# EAGLE schematic 2nd to final draft (EAGLE 8.1.0)

## Sheet 1 of 2
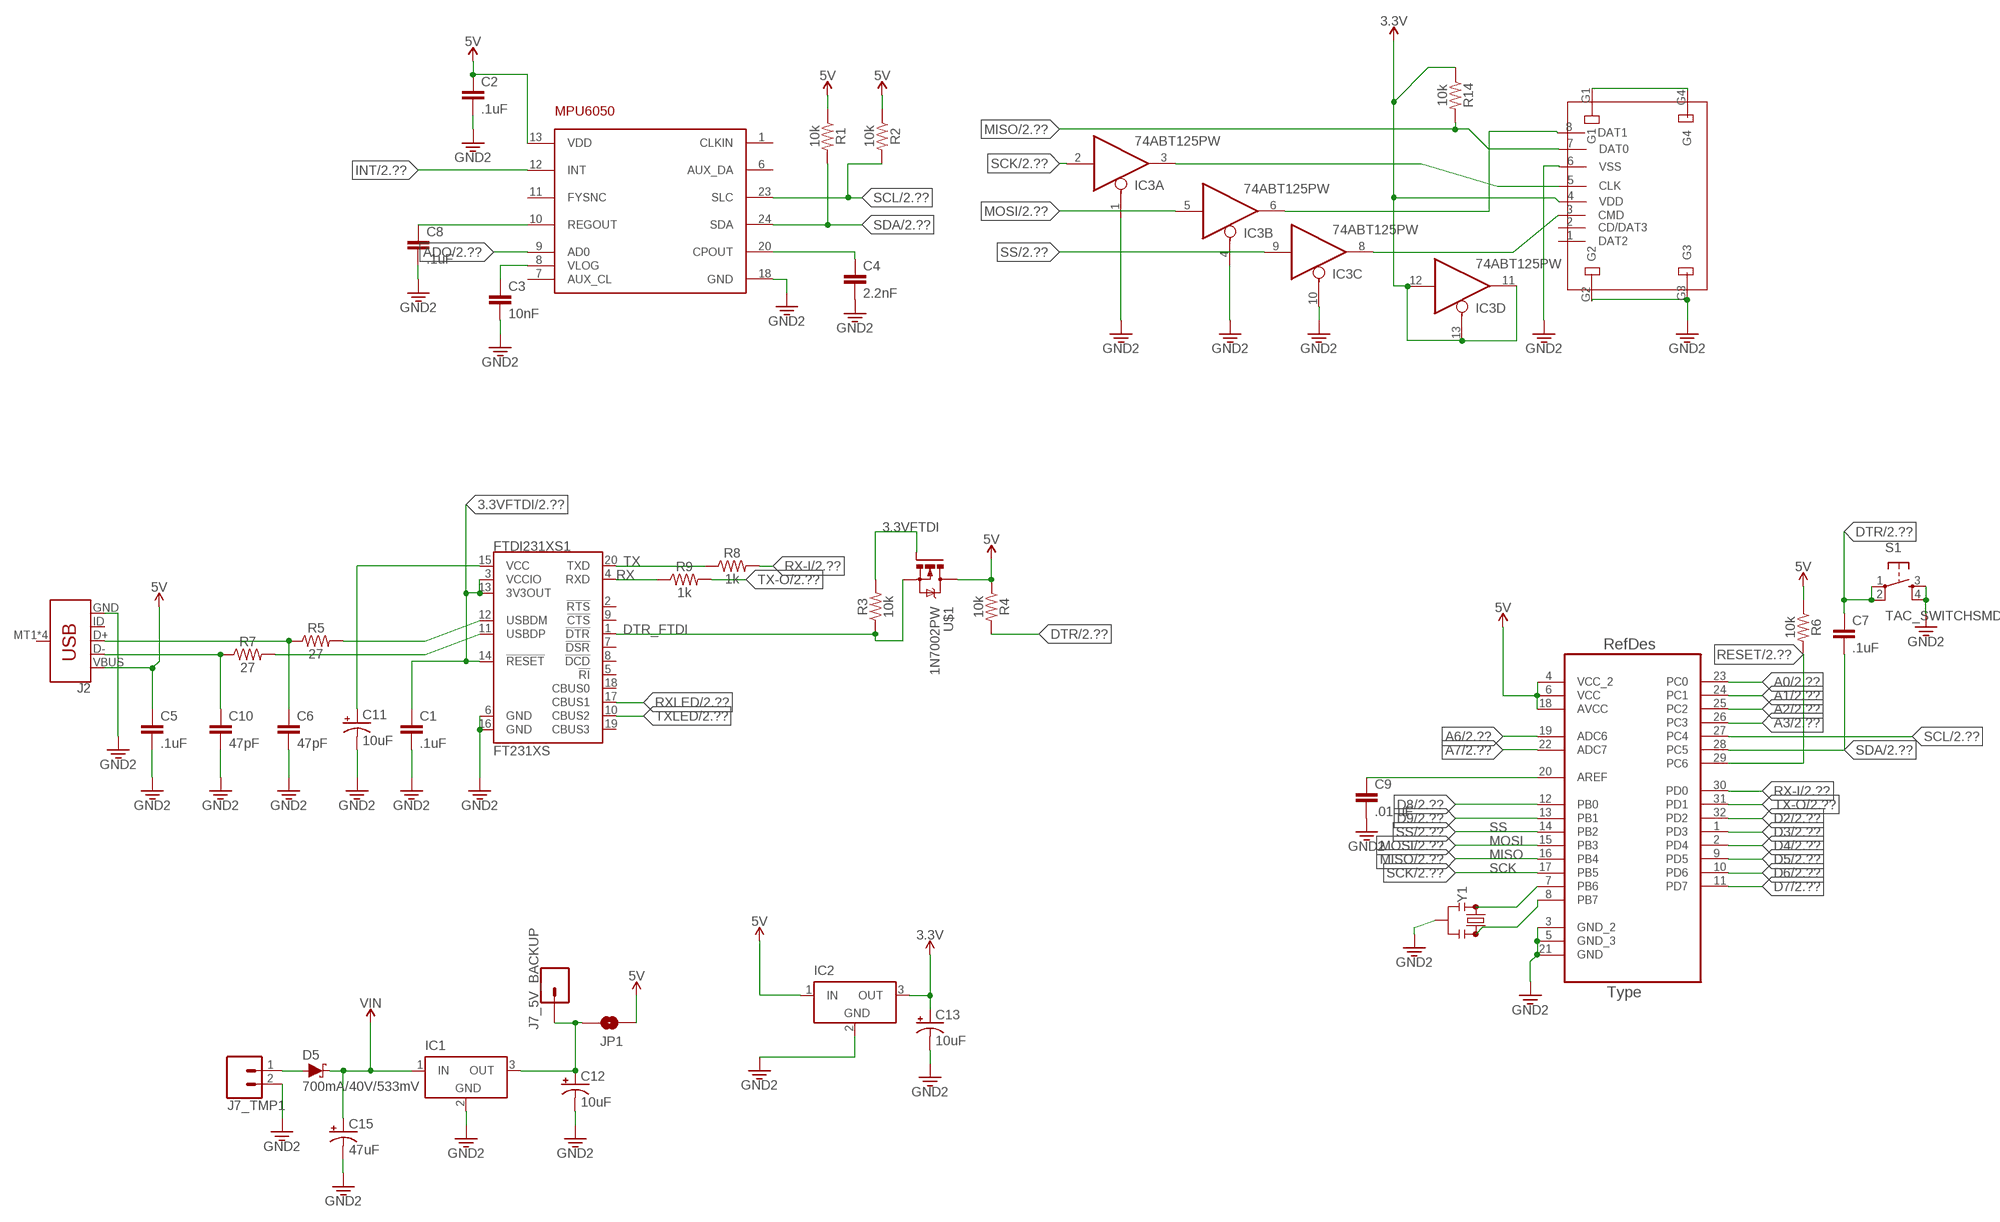
[diagram p0: schematic, sheet 1, part 1 of 2]
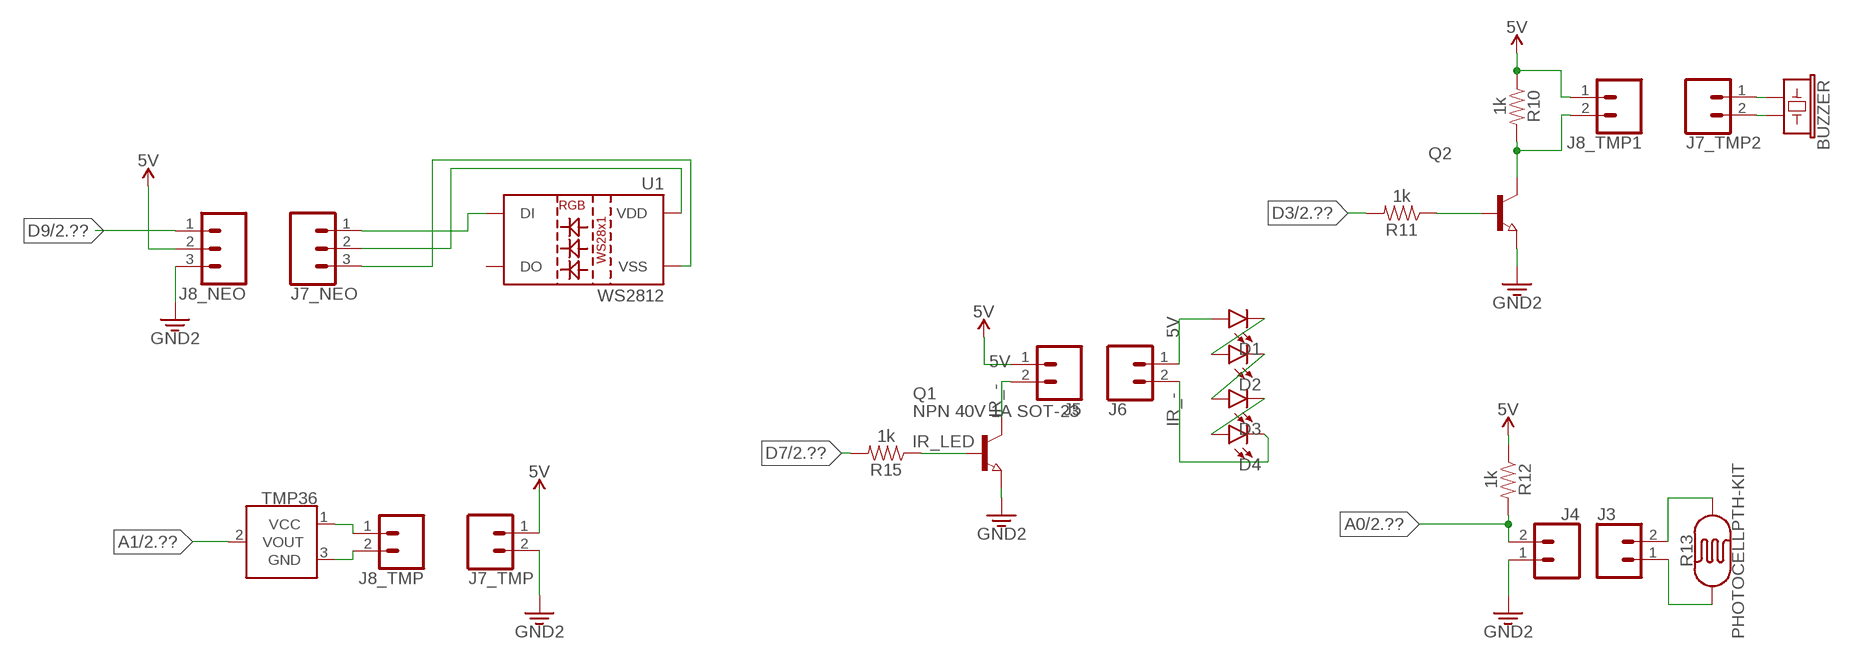
[diagram p1: schematic, sheet 1, part 2 of 2]

### Parts
ATMEGA328P-AU  ATMEGA328P-AU  [QFP80P900X900X120-32N]
BUZZER  BUZZER-PTH  [BUZZER-12MM]
C1  .1uF  .22UF-CER  [0402-CAP]
C2  .1uF  .22UF-CER  [0402-CAP]
C3  10nF  .22UF-CER  [0402-CAP]
C4  2.2nF  .22UF-CER  [0402-CAP]
C5  .1uF  .22UF-CER  [0402-CAP]
C6  47pF  .22UF-CER  [0402-CAP]
C7  .1uF  .22UF-CER  [0402-CAP]
C8  .1uF  .22UF-CER  [0402-CAP]
C9  .01 uF  .22UF-CER  [0402-CAP]
C10  47pF  .22UF-CER  [0402-CAP]
C11  10uF  10UF-TANT  [EIA3216]
C12  10uF  10UF-TANT  [EIA3216]
C13  10uF  10UF-TANT  [EIA3216]
C15  47uF  10UF-TANT  [EIA3216]
D1  LED-IRTSAL6100  [LED_5MM]
D2  LED-IRTSAL6100  [LED_5MM]
D3  LED-IRTSAL6100  [LED_5MM]
D4  LED-IRTSAL6100  [LED_5MM]
D5  700mA/40V/533mV  DIODE-SCHOTTKY-ZLLS500  [SOT23-3]
FTDI231XS1  FT231XS  [SSOP20_L]
IC1  LT1129CST5  [SOT223]
IC2  LT1129CST5  [SOT223]
IC3  74ABT125PW  [TSSOP14]
J2  USB_MICRO-B_SMT  [USB-MICROB]
J3  CONN_02LOCK  [1X02_LOCK]
J4  CONN_02LOCK  [1X02_LOCK]
J5  CONN_02LOCK  [1X02_LOCK]
J6  CONN_02LOCK  [1X02_LOCK]
J7_5V_BACKUP  CONN_01  [1X01]
J7_NEO  CONN_03-SCREW-5MM  [SCREWTERMINAL-5MM-3]
J7_TMP  CONN_02LOCK  [1X02_LOCK]
J7_TMP1  CONN_02LOCK  [1X02_LOCK]
J7_TMP2  CONN_02LOCK  [1X02_LOCK]
J8_NEO  CONN_03-SCREW-5MM  [SCREWTERMINAL-5MM-3]
J8_TMP  CONN_02LOCK  [1X02_LOCK]
J8_TMP1  CONN_02LOCK  [1X02_LOCK]
JP1  JUMPER-SMT_2_NO_NO-SILK_ROUND  [SMT-JUMPER_2_NO_NO-SILK_ROUND]
MPU6050  MPU-6050  [QFN24-4X4]
Q1  NPN 40V 1A SOT-23  NPN-TRANSISTOR_SOT23  [SOT23]
Q2  NPN-TRANSISTOR_SOT23  [SOT23]
R1  10k  0.05OHM-0603-1/5W-1%  [0603]
R2  10k  0.05OHM-0603-1/5W-1%  [0603]
R3  10k  0.05OHM-0603-1/5W-1%  [0603]
R4  10k  0.05OHM-0603-1/5W-1%  [0603]
R5  27  0.05OHM-0603-1/5W-1%  [0603]
R6  10k  0.05OHM-0603-1/5W-1%  [0603]
R7  27  0.05OHM-0603-1/5W-1%  [0603]
R8  1k  0.05OHM-0603-1/5W-1%  [0603]
R9  1k  0.05OHM-0603-1/5W-1%  [0603]
R10  1k  0.05OHM-0603-1/5W-1%  [0603]
R11  1k  0.05OHM-0603-1/5W-1%  [0603]
R12  1k  0.05OHM-0603-1/5W-1%  [0603]
R13  PHOTOCELLPTH-KIT  [PHOTOCELL-KIT]
R14  10k  0.05OHM-0603-1/5W-1%  [0603]
R15  1k  0.05OHM-0603-1/5W-1%  [0603]
S1  TAC_SWITCHSMD  [TACTILE-SWITCH-SMD]
TMP36  TMP36GT9  [TO-92]
U1  WS2812  WS2812"  [LED-TRICOLOR-5050-IC]
U$1  1N7002PW  [SOT323W_INFINEON]
U$2  WM6698TR-ND_MICROSD  [MICROSD_DIGIKEY]
Y1  RESONATORSMD-7.4X3.4  [RESONATOR-SMD-7.4X3.4]

### Nets
3.3V: ATMEGA328P-AU.3(GND_2) ATMEGA328P-AU.5(GND_3) ATMEGA328P-AU.21(GND) C1.2 C2.2 C3.2 C4.2 C5.2 C6.2 C8.2 C9.2 C10.2 C11.C(-) C12.C(-) C13.C(-) C15.C(-) FTDI231XS1.6(GND) FTDI231XS1.16(GND) IC1.2(GND) IC2.2(GND) IC3.1(A:OE) IC3.4(B:OE) IC3.10(C:OE) J2.GND J7_TMP1.2 J8_NEO.3 MPU6050.18(GND) Q1.2(E) Q2.2(E) S1.3 S1.4 U$2.6(VSS) U$2.G2 U$2.G3 Y1.2 ; supply symbol labelled GND2 ; also sheet 2
3.3VFTDI: C1.1 FTDI231XS1.3(VCCIO) FTDI231XS1.13(3V3OUT) FTDI231XS1.14(!RESET) R3.2 U$1.1(G) ; also sheet 2
5V: ATMEGA328P-AU.4(VCC_2) ATMEGA328P-AU.6(VCC) ATMEGA328P-AU.18(AVCC) C2.1 C5.1 D1.A IC2.1(IN) J2.VBUS J5.1 J6.1 J7_NEO.1 J8_NEO.2 JP1.1 MPU6050.13(VDD) R1.1 R2.1 R4.1 R6.1 R12.1 U1.2(DI) U$1.3(D) ; also sheet 2
A0: ATMEGA328P-AU.23(PC0) J3.2 J4.2 R12.2 R13.2 ; also sheet 2
A1: ATMEGA328P-AU.24(PC1) TMP36.2(VOUT) ; also sheet 2
A2: ATMEGA328P-AU.25(PC2) ; also sheet 2
A3: ATMEGA328P-AU.26(PC3) ; also sheet 2
A6: ATMEGA328P-AU.19(ADC6) ; also sheet 2
A7: ATMEGA328P-AU.22(ADC7) ; also sheet 2
ADO: MPU6050.9(AD0) ; also sheet 2
BUZ+: BUZZER.+ J7_TMP2.1 J8_TMP1.1 R10.1 ; supply symbol labelled 5V
BUZ-: BUZZER.- J7_TMP2.2 J8_TMP1.2 Q2.3(C) R10.2
D2: ATMEGA328P-AU.32(PD2) ; also sheet 2
D3: ATMEGA328P-AU.1(PD3) R11.2 ; also sheet 2
D4: ATMEGA328P-AU.2(PD4) ; also sheet 2
D5: ATMEGA328P-AU.9(PD5) ; also sheet 2
D6: ATMEGA328P-AU.10(PD6) ; also sheet 2
D7: ATMEGA328P-AU.11(PD7) R15.2 ; also sheet 2
D8: ATMEGA328P-AU.12(PB0) ; also sheet 2
D9: ATMEGA328P-AU.13(PB1) J7_NEO.2 J8_NEO.1 U1.3(VDD) U1.5(VDD) ; also sheet 2
DTR: C7.1 R4.2 S1.1 S1.2 ; also sheet 2
DTR_FTDI: FTDI231XS1.1(!DTR) R3.1 U$1.2(S) ; also sheet 2
GND: J3.1 J4.1 J7_NEO.3 R13.1 U1.6(VSS) ; supply symbol labelled GND2
INT: MPU6050.12(INT) ; also sheet 2
IR_-: D4.K(C) J5.2 J6.2 Q1.3(C)
IR_LED: Q1.1(B) R15.1
MISO: ATMEGA328P-AU.16(PB4) R14.2 U$2.7(DAT0) ; also sheet 2
MOSI: ATMEGA328P-AU.15(PB3) IC3.5(B:I) ; also sheet 2
N$1: ATMEGA328P-AU.7(PB6) Y1.1
N$2: ATMEGA328P-AU.8(PB7) Y1.3
N$3: C4.1 MPU6050.20(CPOUT)
N$4: C8.1 MPU6050.10(REGOUT)
N$5: C3.1 MPU6050.8(VLOG)
N$6: ATMEGA328P-AU.20(AREF) C9.1
N$7: C6.1 J2.D+ R5.1
N$8: U$2.G1 U$2.G4
N$9: IC3.3(A:O) U$2.5(CLK)
N$10: IC3.6(B:O) U$2.8(DAT1)
N$11: IC3.8(C:O) U$2.3(CMD)
N$13: C10.1 J2.D- R7.1
N$14: FTDI231XS1.11(USBDP) R7.2
N$15: FTDI231XS1.12(USBDM) R5.2
N$16: C11.A(+) FTDI231XS1.15(VCC)
N$18: D1.K(C) D2.A
N$19: D2.K(C) D3.A
N$20: Q2.1(B) R11.1
N$21: D3.K(C) D4.A
N$22: D5.1(A) J7_TMP1.1
N$23: C12.A(+) IC1.3(OUT) J7_5V_BACKUP.1 JP1.2
RESET: ATMEGA328P-AU.29(PC6) R6.2 ; also sheet 2
RX: FTDI231XS1.4(RXD) R9.1 ; also sheet 2
RX-I: ATMEGA328P-AU.30(PD0) R8.2 ; also sheet 2
RXLED: FTDI231XS1.17(CBUS1) ; also sheet 2
SCK: ATMEGA328P-AU.17(PB5) IC3.2(A:I) ; also sheet 2
SCL: ATMEGA328P-AU.27(PC4) MPU6050.23(SLC) R2.2 ; also sheet 2
SDA: ATMEGA328P-AU.28(PC5) C7.2 MPU6050.24(SDA) R1.2 ; also sheet 2
SS: ATMEGA328P-AU.14(PB2) IC3.9(C:I) ; also sheet 2
TMP+: J7_TMP.1 J8_TMP.1 TMP36.1(VCC) ; supply symbol labelled 5V
TMP-: J7_TMP.2 J8_TMP.2 TMP36.3(GND) ; supply symbol labelled GND2
TX: FTDI231XS1.20(TXD) R8.1 ; also sheet 2
TX-O: ATMEGA328P-AU.31(PD1) R9.2 ; also sheet 2
TXLED: FTDI231XS1.10(CBUS2) ; also sheet 2
VCC: C13.A(+) IC2.3(OUT) IC3.11(D:O) IC3.12(D:I) IC3.13(D:OE) R14.1 U$2.4(VDD) ; supply symbol labelled 3.3V ; also sheet 2
VIN: C15.A(+) D5.3(C) IC1.1(IN) ; also sheet 2
Unconnected: FTDI231XS1.2(!RTS) FTDI231XS1.5(!RI) FTDI231XS1.7(!DSR) FTDI231XS1.8(!DCD) FTDI231XS1.9(!CTS) FTDI231XS1.18(CBUS0) FTDI231XS1.19(CBUS3) J2.ID J2.MT1(SHIELD) J2.MT2(SHIELD) J2.P$1(SHIELD) J2.P$2(SHIELD) MPU6050.1(CLKIN) MPU6050.6(AUX_DA) MPU6050.7(AUX_CL) MPU6050.11(FYSNC) U1.1(DO) U$2.1(DAT2) U$2.2(CD/DAT3)

## Sheet 2 of 2
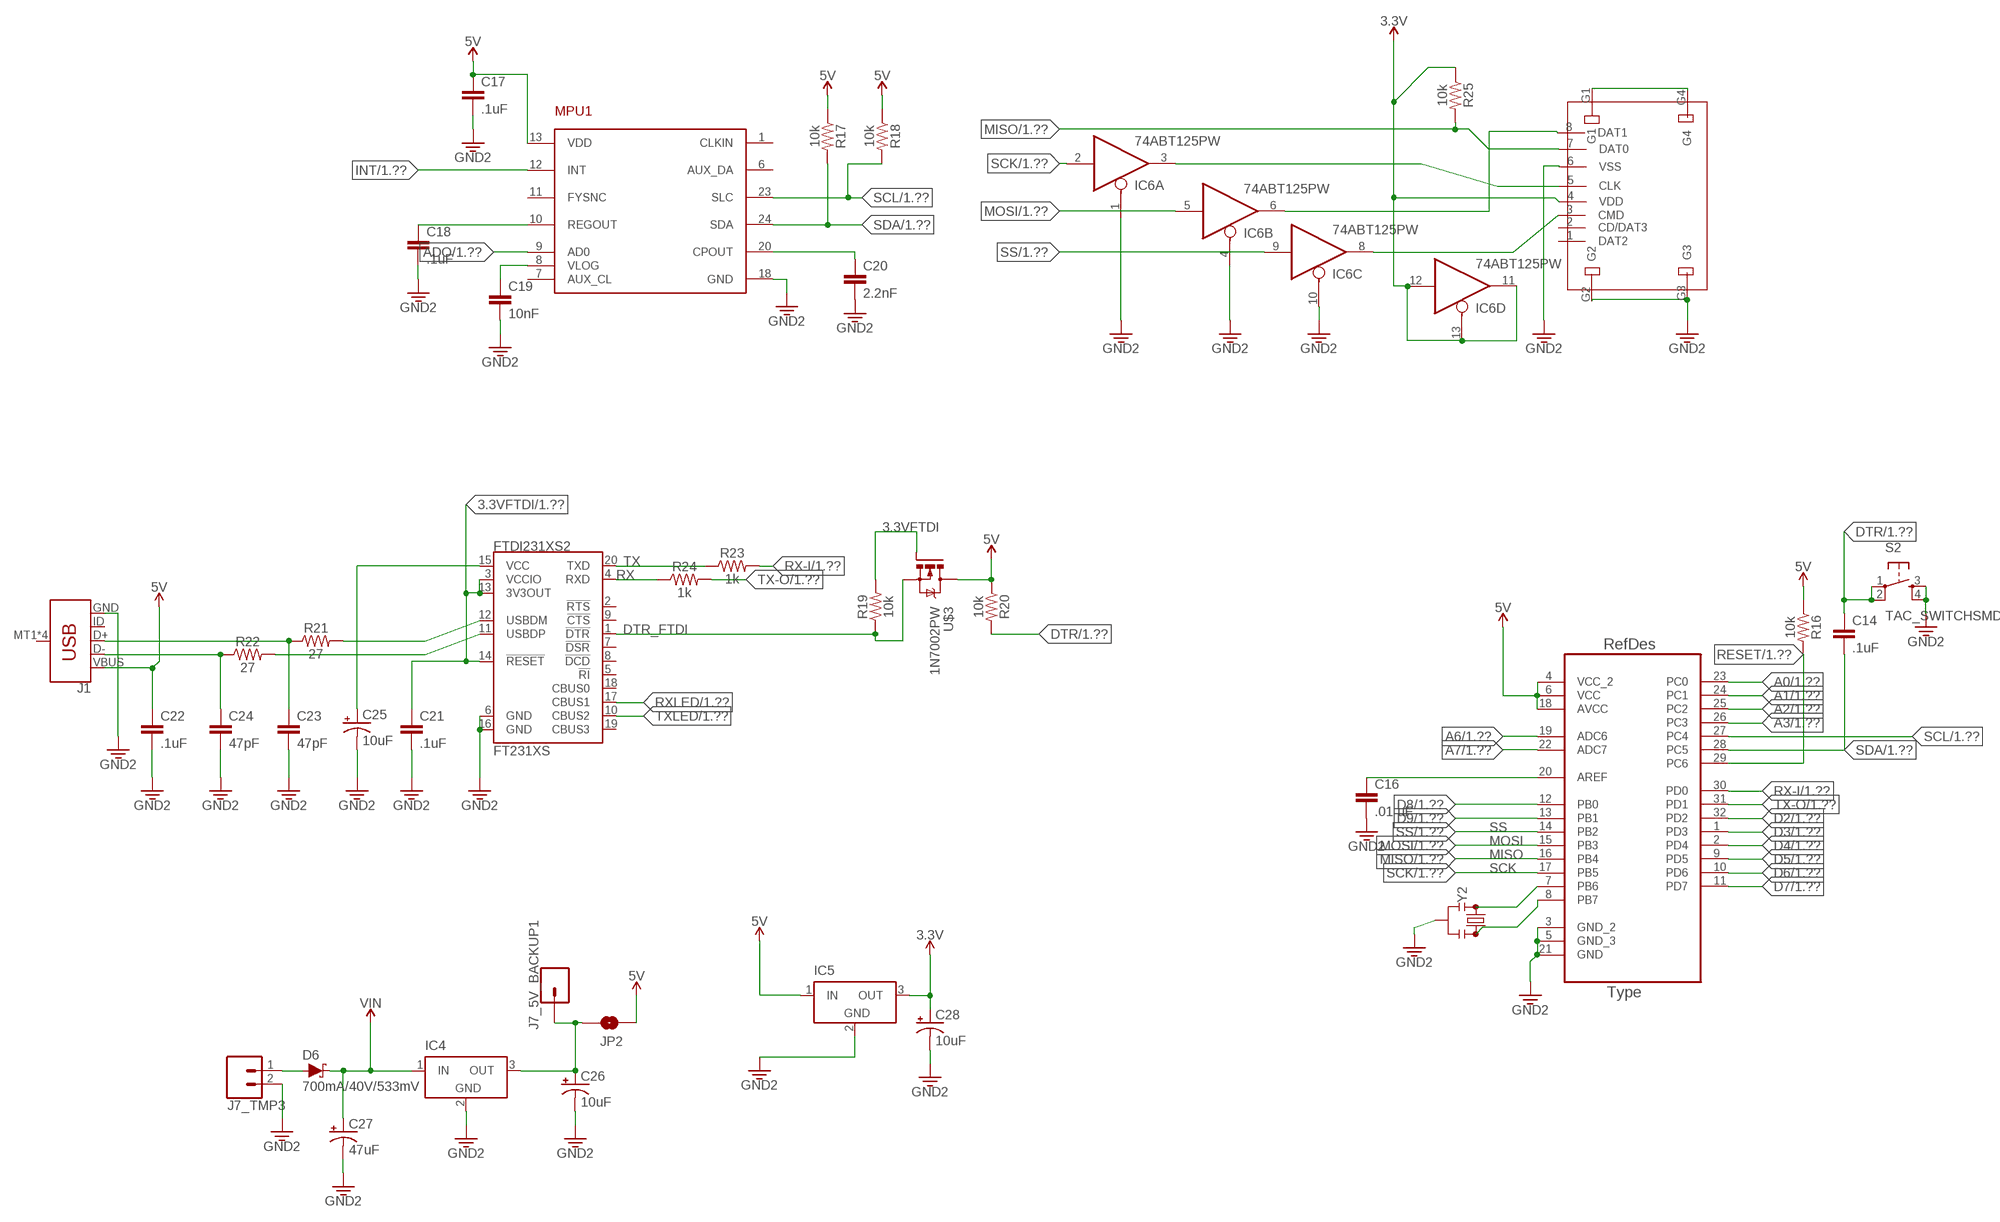
[diagram p2: schematic, sheet 2]

### Parts
ATMEGA328P-AU1  ATMEGA328P-AU  [QFP80P900X900X120-32N]
C14  .1uF  .22UF-CER  [0402-CAP]
C16  .01 uF  .22UF-CER  [0402-CAP]
C17  .1uF  .22UF-CER  [0402-CAP]
C18  .1uF  .22UF-CER  [0402-CAP]
C19  10nF  .22UF-CER  [0402-CAP]
C20  2.2nF  .22UF-CER  [0402-CAP]
C21  .1uF  .22UF-CER  [0402-CAP]
C22  .1uF  .22UF-CER  [0402-CAP]
C23  47pF  .22UF-CER  [0402-CAP]
C24  47pF  .22UF-CER  [0402-CAP]
C25  10uF  10UF-TANT  [EIA3216]
C26  10uF  10UF-TANT  [EIA3216]
C27  47uF  10UF-TANT  [EIA3216]
C28  10uF  10UF-TANT  [EIA3216]
D6  700mA/40V/533mV  DIODE-SCHOTTKY-ZLLS500  [SOT23-3]
FTDI231XS2  FT231XS  [SSOP20_L]
IC4  LT1129CST5  [SOT223]
IC5  LT1129CST5  [SOT223]
IC6  74ABT125PW  [TSSOP14]
J1  USB_MICRO-B_SMT  [USB-MICROB]
J7_5V_BACKUP1  CONN_01  [1X01]
J7_TMP3  CONN_02LOCK  [1X02_LOCK]
JP2  JUMPER-SMT_2_NO_NO-SILK_ROUND  [SMT-JUMPER_2_NO_NO-SILK_ROUND]
MPU1  MPU-6050  [QFN24-4X4]
R16  10k  0.05OHM-0603-1/5W-1%  [0603]
R17  10k  0.05OHM-0603-1/5W-1%  [0603]
R18  10k  0.05OHM-0603-1/5W-1%  [0603]
R19  10k  0.05OHM-0603-1/5W-1%  [0603]
R20  10k  0.05OHM-0603-1/5W-1%  [0603]
R21  27  0.05OHM-0603-1/5W-1%  [0603]
R22  27  0.05OHM-0603-1/5W-1%  [0603]
R23  1k  0.05OHM-0603-1/5W-1%  [0603]
R24  1k  0.05OHM-0603-1/5W-1%  [0603]
R25  10k  0.05OHM-0603-1/5W-1%  [0603]
S2  TAC_SWITCHSMD  [TACTILE-SWITCH-SMD]
U$3  1N7002PW  [SOT323W_INFINEON]
U$4  WM6698TR-ND_MICROSD  [MICROSD_DIGIKEY]
Y2  RESONATORSMD-7.4X3.4  [RESONATOR-SMD-7.4X3.4]

### Nets
3.3V: ATMEGA328P-AU1.3(GND_2) ATMEGA328P-AU1.5(GND_3) ATMEGA328P-AU1.21(GND) C16.2 C17.2 C18.2 C19.2 C20.2 C21.2 C22.2 C23.2 C24.2 C25.C(-) C26.C(-) C27.C(-) C28.C(-) FTDI231XS2.6(GND) FTDI231XS2.16(GND) IC4.2(GND) IC5.2(GND) IC6.1(A:OE) IC6.4(B:OE) IC6.10(C:OE) J1.GND J7_TMP3.2 MPU1.18(GND) S2.3 S2.4 U$4.6(VSS) U$4.G2 U$4.G3 Y2.2 ; supply symbol labelled GND2 ; also sheet 1
3.3VFTDI: C21.1 FTDI231XS2.3(VCCIO) FTDI231XS2.13(3V3OUT) FTDI231XS2.14(!RESET) R19.2 U$3.1(G) ; also sheet 1
5V: ATMEGA328P-AU1.4(VCC_2) ATMEGA328P-AU1.6(VCC) ATMEGA328P-AU1.18(AVCC) C17.1 C22.1 IC5.1(IN) J1.VBUS JP2.1 MPU1.13(VDD) R16.1 R17.1 R18.1 R20.1 U$3.3(D) ; also sheet 1
A0: ATMEGA328P-AU1.23(PC0) ; also sheet 1
A1: ATMEGA328P-AU1.24(PC1) ; also sheet 1
A2: ATMEGA328P-AU1.25(PC2) ; also sheet 1
A3: ATMEGA328P-AU1.26(PC3) ; also sheet 1
A6: ATMEGA328P-AU1.19(ADC6) ; also sheet 1
A7: ATMEGA328P-AU1.22(ADC7) ; also sheet 1
ADO: MPU1.9(AD0) ; also sheet 1
D2: ATMEGA328P-AU1.32(PD2) ; also sheet 1
D3: ATMEGA328P-AU1.1(PD3) ; also sheet 1
D4: ATMEGA328P-AU1.2(PD4) ; also sheet 1
D5: ATMEGA328P-AU1.9(PD5) ; also sheet 1
D6: ATMEGA328P-AU1.10(PD6) ; also sheet 1
D7: ATMEGA328P-AU1.11(PD7) ; also sheet 1
D8: ATMEGA328P-AU1.12(PB0) ; also sheet 1
D9: ATMEGA328P-AU1.13(PB1) ; also sheet 1
DTR: C14.1 R20.2 S2.1 S2.2 ; also sheet 1
DTR_FTDI: FTDI231XS2.1(!DTR) R19.1 U$3.2(S) ; also sheet 1
INT: MPU1.12(INT) ; also sheet 1
MISO: ATMEGA328P-AU1.16(PB4) R25.2 U$4.7(DAT0) ; also sheet 1
MOSI: ATMEGA328P-AU1.15(PB3) IC6.5(B:I) ; also sheet 1
N$32: ATMEGA328P-AU1.20(AREF) C16.1
N$33: ATMEGA328P-AU1.7(PB6) Y2.1
N$34: ATMEGA328P-AU1.8(PB7) Y2.3
N$35: C20.1 MPU1.20(CPOUT)
N$36: C18.1 MPU1.10(REGOUT)
N$37: C19.1 MPU1.8(VLOG)
N$38: C23.1 J1.D+ R21.1
N$39: C24.1 J1.D- R22.1
N$40: FTDI231XS2.11(USBDP) R22.2
N$41: FTDI231XS2.12(USBDM) R21.2
N$42: C25.A(+) FTDI231XS2.15(VCC)
N$43: D6.1(A) J7_TMP3.1
N$44: C26.A(+) IC4.3(OUT) J7_5V_BACKUP1.1 JP2.2
N$45: U$4.G1 U$4.G4
N$46: IC6.3(A:O) U$4.5(CLK)
N$47: IC6.6(B:O) U$4.8(DAT1)
N$48: IC6.8(C:O) U$4.3(CMD)
RESET: ATMEGA328P-AU1.29(PC6) R16.2 ; also sheet 1
RX: FTDI231XS2.4(RXD) R24.1 ; also sheet 1
RX-I: ATMEGA328P-AU1.30(PD0) R23.2 ; also sheet 1
RXLED: FTDI231XS2.17(CBUS1) ; also sheet 1
SCK: ATMEGA328P-AU1.17(PB5) IC6.2(A:I) ; also sheet 1
SCL: ATMEGA328P-AU1.27(PC4) MPU1.23(SLC) R18.2 ; also sheet 1
SDA: ATMEGA328P-AU1.28(PC5) C14.2 MPU1.24(SDA) R17.2 ; also sheet 1
SS: ATMEGA328P-AU1.14(PB2) IC6.9(C:I) ; also sheet 1
TX: FTDI231XS2.20(TXD) R23.1 ; also sheet 1
TX-O: ATMEGA328P-AU1.31(PD1) R24.2 ; also sheet 1
TXLED: FTDI231XS2.10(CBUS2) ; also sheet 1
VCC: C28.A(+) IC5.3(OUT) IC6.11(D:O) IC6.12(D:I) IC6.13(D:OE) R25.1 U$4.4(VDD) ; supply symbol labelled 3.3V ; also sheet 1
VIN: C27.A(+) D6.3(C) IC4.1(IN) ; also sheet 1
Unconnected: FTDI231XS2.2(!RTS) FTDI231XS2.5(!RI) FTDI231XS2.7(!DSR) FTDI231XS2.8(!DCD) FTDI231XS2.9(!CTS) FTDI231XS2.18(CBUS0) FTDI231XS2.19(CBUS3) J1.ID J1.MT1(SHIELD) J1.MT2(SHIELD) J1.P$1(SHIELD) J1.P$2(SHIELD) MPU1.1(CLKIN) MPU1.6(AUX_DA) MPU1.7(AUX_CL) MPU1.11(FYSNC) U$4.1(DAT2) U$4.2(CD/DAT3)

## Power pins joined to a net without a drawn wire
GND: IC1.4(GND) IC2.4(GND) IC3.7(P:GND) IC4.4(GND) IC5.4(GND) IC6.7(P:GND)
VCC: IC3.14(P:VCC) IC6.14(P:VCC)

## Library data of the parts
ATMEGA328P-AU ATMEGA328P-AU1 = Atmega-328pu:ATMEGA328P-AU; DESCRIPTION: 8-bit Microcontroller with In-System Programmable Flash; MPN: ATMEGA328P-AU; OC_FARNELL: 1715486; OC_NEWARK: 14R4631; PACKAGE: TQFP-32; SUPPLIER: Atmel
BUZZER = SparkFun-Electromechanical:BUZZER: Buzzer Small round buzzers that operate around the audible 2kHz range. You can use these as speakers to create simple music or user interfaces. Variant Overview: PTH - Mini Speaker - PC Mount 12mm 2.048kHz <https://www.sparkfun.com/products/7950> PTH_KIT - Mini Speaker - PC Mount 12mm 2.048kHz <https://www.sparkfun.com/products/7950> KIT simplifies soldering by adding stop mask to one side of the pads. PTH_NO_SILK - Mini Speaker - PC Mount 12mm 2.048kHz <https://www.sparkfun.com/products/7950> No silkscreen indicator of buzzer outline. PTH_KIT_NO_SILK - Mini Speaker - PC Mount 12mm 2.048kHz <https://www.sparkfun.com/products/7950> KIT package w/o silkscreen SMD - Buzzer Audio Magnetic (CCV-084B16) SMD buzzer used on, e.g. the LilyPad Buzzer <https://www.sparkfun.com/products/8463> and RFID USB Reader <https://www.sparkfun.com/products/9963>. SMD_KIT - Buzzer Audio Magnetic (CCV-084B16) SMD Buzzer with elongated pins to make soldering easier. Used on the SparkFun Simon Says - Surface Mount Soldering Kit <https://www.sparkfun.com/products/10935>.; PROD_ID: COMP-08253; SF_SKU: COM-07950
C1-C10 C14 C16-C24 = SparkFun-Retired:.22UF-CER: .22uF ceramic SMT CAP-09885- 50V +80%/-20% (0603); PROD_ID: CAP-09885; VALUE: .22uF
C11-C13 C25 C26 C28 = SparkFun-Retired:10UF-TANT: 10uF Tantalum SMT CAP-00811- 16V 10% (EIA-3216); PROD_ID: CAP-00811
C15 C27 = SparkFun-Retired:10UF-TANT: 10uF Tantalum SMT CAP-00811- 16V 10% (EIA-3216); PROD_ID: CAP-00811; VALUE: 10uF
D1-D4 = SparkFun-LED:LED-IR: Infrared LED (IR) Wavelength: 940nm Packages: TSAL6100 LTE302 - Side firing. Check SparkFun-Sensors.lbr for the receiver SparkFun Products: ZX Distance and Gesture Sensor <[https://www.sparkfun.com/products/12780]> Infrared Emitters and Detectors <https://www.sparkfun.com/products/241>; PROD_ID: DIO-12058
D5 D6 = SparkFun-DiscreteSemi:DIODE-SCHOTTKY: Schottky diode A Schottky diode is a semiconductor diode which has a low forward voltage drop and a very fast switching action.; PROD_ID: DIO-08411
FTDI231XS1 FTDI231XS2 = SparkFun-IC-Comms:FT231X: FTDI FT231X Full Speed USB to Full-handshake UART This USB2.0 Full Speed IC offers a compact bridge to full handshake UART interfaces. The device is a UART, capable of operating up to 3MBaud, with low power consumption (8mA). The FT231X includes the complete FT-X series feature set and enables USB to be added into a system design quickly and easily over a UART interface. Datasheet <http://cdn.sparkfun.com/datasheets/Components/General%20IC/DS_FT231X.pdf> SparkFun Products SparkFun RedBoard - Programmed with Arduino <https://www.sparkfun.com/products/12757> (DEV-12757) SparkFun XBee Explorer USB <https://www.sparkfun.com/products/11812> (WRL-11812) SparkFun XBee Explorer Dongle <https://www.sparkfun.com/products/11697> (WRL-11697) SparkFun Blynk Board - ESP8266 <https://www.sparkfun.com/products/13794> (WRL-13794) SparkFun ESP8266 Thing - Dev Board <https://www.sparkfun.com/products/13711> (WRL-13711) SparkFun Block for Intel® Edison - Base <https://www.sparkfun.com/products/13045> (DEV-13045) SparkFun RedStick <https://www.sparkfun.com/products/13741> (DEV-13741) SparkFun Beefy 3 - FTDI Basic Breakout <https://www.sparkfun.com/products/13746> (DEV-13746) SparkFun FT231X Breakout <https://www.sparkfun.com/products/11736> (BOB-11736); PROD_ID: IC-11524
IC1 IC2 IC4 IC5 = linear-technology:LT1129CST5: VOLTAGE REGULATOR with shutdown; MPN: LT1129CST-5#PBF; OC_FARNELL: 1663375; OC_NEWARK: 57M2069
IC3 IC6 = 74xx-us:74*125: Quad bus BUFFER, 3-state
J1 J2 = SparkFun-Connectors:USB_MICRO-B: USB Type Micro-B Connector Male/female and PTH/SMT variants SparkFun Products: SparkFun microB USB Breakout <https://www.sparkfun.com/products/12035> SparkFun USB microB Plug Breakout <https://www.sparkfun.com/products/10031> SparkFun ESP8266 Thing <https://www.sparkfun.com/products/13231>; PROD_ID: CONN-09505; SF_ID: PRT-08533
J3-J6 J7_TMP J7_TMP1-J7_TMP3 J8_TMP J8_TMP1 = SparkFun-Connectors:CONN_02: Multi connection point. Often used as Generic Header-pin footprint for 0.1 inch spaced/style header connections On any of the 0.1 inch spaced packages, you can populate with these: Break Away Headers - Straight <https://www.sparkfun.com/products/116> (PRT-00116) Break Away Male Headers - Right Angle <https://www.sparkfun.com/products/553> (PRT-00553) Female Headers <https://www.sparkfun.com/products/115> (PRT-00115) Break Away Headers - Machine Pin <https://www.sparkfun.com/products/117> (PRT-00117) Break Away Female Headers - Swiss Machine Pin <https://www.sparkfun.com/products/743> (PRT-00743) For SCREWTERMINALS and SPRING TERMINALS visit here: Screw Terimnals on SparkFun.com <https://www.sparkfun.com/search/results?term=Screw+Terminals> (5mm/3.5mm/2.54mm spacing) This device is also useful as a general connection point to wire up your design to another part of your project. Our various solder wires solder well into these plated through hole pads. Hook-Up Wire - Assortment (Stranded, 22 AWG) <https://www.sparkfun.com/products/11375> (PRT-11375) Hook-Up Wire - Assortment (Solid Core, 22 AWG) <https://www.sparkfun.com/products/11367> (PRT-11367) View the entire wire category on our website here <https://www.sparkfun.com/categories/141> Special notes: Molex polarized connector foot print use with: PRT-08233 with associated crimp pins and housings. 2.54_SCREWTERM for use with PRT-10571. 3.5mm Screw Terminal footprints for PRT-08084 5mm Screw Terminal footprints for use with PRT-08432
J7_5V_BACKUP J7_5V_BACKUP1 = SparkFun-Connectors:CONN_01: Single connection point. Often used as Generic Header-pin footprint for 0.1 inch spaced/style header connections On any of the 0.1 inch spaced packages, you can populate with these: Break Away Headers - Straight <https://www.sparkfun.com/products/116> (PRT-00116) Break Away Male Headers - Right Angle <https://www.sparkfun.com/products/553> (PRT-00553) Female Headers <https://www.sparkfun.com/products/115> (PRT-00115) Break Away Headers - Machine Pin <https://www.sparkfun.com/products/117> (PRT-00117) Break Away Female Headers - Swiss Machine Pin <https://www.sparkfun.com/products/743> (PRT-00743) This device is also useful as a general connection point to wire up your design to another part of your project. Our various solder wires solder well into these plated through hole pads. Hook-Up Wire - Assortment (Stranded, 22 AWG) <https://www.sparkfun.com/products/11375> (PRT-11375) Hook-Up Wire - Assortment (Solid Core, 22 AWG) <https://www.sparkfun.com/products/11367> (PRT-11367) View the entire wire category on our website here <https://www.sparkfun.com/categories/141> Special notes: SMTSO-256-ET is a "flush mount" nut for a 4-40 screw. We mostly use this on specialty testbeds; it is a nice way to connect hardware to your PCB at an adjustable hieght. Also note, the SNAP packages are for using a snappable style connector. We sell a baggie of snaps and they are also used on two LilyPad designs: Snap Assortment - 30 pack (male and female) <https://www.sparkfun.com/products/11347> (DEV-11347) LilyPad Arduino SimpleSnap <https://www.sparkfun.com/products/10941> (DEV-10941) LilyPad SimpleSnap Protoboard <https://www.sparkfun.com/products/10940> (DEV-10940)
J7_NEO J8_NEO = SparkFun-Connectors:CONN_03: Multi connection point. Often used as Generic Header-pin footprint for 0.1 inch spaced/style header connections On any of the 0.1 inch spaced packages, you can populate with these: Break Away Headers - Straight <https://www.sparkfun.com/products/116> (PRT-00116) Break Away Male Headers - Right Angle <https://www.sparkfun.com/products/553> (PRT-00553) Female Headers <https://www.sparkfun.com/products/115> (PRT-00115) Break Away Headers - Machine Pin <https://www.sparkfun.com/products/117> (PRT-00117) Break Away Female Headers - Swiss Machine Pin <https://www.sparkfun.com/products/743> (PRT-00743) Stackable Header - 3 Pin (Female, 0.1") <https://www.sparkfun.com/products/13875> (PRT-13875) For SCREWTERMINALS and SPRING TERMINALS visit here: Screw Terimnals on SparkFun.com <https://www.sparkfun.com/search/results?term=Screw+Terminals> (5mm/3.5mm/2.54mm spacing) This device is also useful as a general connection point to wire up your design to another part of your project. Our various solder wires solder well into these plated through hole pads. Hook-Up Wire - Assortment (Stranded, 22 AWG) <https://www.sparkfun.com/products/11375> (PRT-11375) Hook-Up Wire - Assortment (Solid Core, 22 AWG) <https://www.sparkfun.com/products/11367> (PRT-11367) View the entire wire category on our website here <https://www.sparkfun.com/categories/141> Special notes: Molex polarized connector foot print use with SKU : PRT-08232 with associated crimp pins and housings.; PROD_ID: CONN-10134; SF_SKU: PRT-08433
JP1 JP2 = SparkFun-Jumpers:JUMPER-SMT_2_NO: Normally open jumper This jumper has two pads in close proximity to each other. Apply solder to close the connection. Round pads are easier to solder for beginners, but are a lot larger. SparkFun Product that uses the round pads: SparkFun EL Sequencer <https://www.sparkfun.com/products/12781>
MPU1 MPU6050 = KevinKuwata1:MPU-6050
Q1 Q2 = semicon-smd-ipc:NPN-TRANSISTOR_: NPN TRANSISTOR
R1-R12 R14-R25 = SparkFun-Resistors:0.05OHM: 0.05Ω resistor A resistor is a passive two-terminal electrical component that implements electrical resistance as a circuit element. Resistors act to reduce current flow, and, at the same time, act to lower voltage levels within circuits. - Wikipedia; PROD_ID: RES-12535; VALUE: 0.05
R13 = SparkFun-Sensors:PHOTOCELL: Photocell (Photodetector, Photo Resistor, CdS) This is a very small light sensor. A photocell changes (also called a photodetector, photo resistor, CdS or photoconductive cell) resistance depending on the amount of light it is exposed to. These little sensors make great ambient light triggers (when light in the room turns on, do something). Datasheet <http://cdn.sparkfun.com/datasheets/Sensors/LightImaging/SEN-09088.pdf> SparkFun Products Mini Photocell <https://www.sparkfun.com/products/9088> (SEN-09088); PROD_ID: COMP-09129; SF_ID: SEN-09088
S1 S2 = SparkFun-Retired:TAC_SWITCH: Momentary Switch Button commonly used for reset or general input. Spark Fun Electronics SKU : COM-00097 SMT- SWCH-08247; PROD_ID: SWCH-08247
TMP36 = SparkFun-Sensors:TMP36: TMP36 Precision Analog °C Temperature Sensor The TMP36 is a low voltage, precision centigrade temperature sensor. It provides a voltage output that is linearly proportional to the Celsius temperature. It also doesn’t require any external calibration to provide typical accuracies of ±1°C at +25°C and ±2°C over the −40°C to +125°C temperature range. We like it because it’s so easy to use: Just give the device a ground and 2.7 to 5.5 VDC and read the voltage on the Vout pin. The output voltage can be converted to temperature easily using the scale factor of 10 mV/°C. Datasheet <http://cdn.sparkfun.com/datasheets/Sensors/Temp/TMP35_36_37.pdf> SparkFun Products Temperature Sensor - TMP36 <https://www.sparkfun.com/products/10988> (SEN-10988) SparkFun Danger Shield <https://www.sparkfun.com/products/11649> (DEV-11649); PROD_ID: IC-09880; SF_ID: SEN-10988
U1 = SparkFun-LED:WS2812: WS2812 RGB LED w/ WS2811 driver 5x5mm SMD LED with built-in controller IC. Color: Red/Green/Blue mC Rating: RGB: 550, 1100, 200 mcd Current:RGB: 20, 20, 20 mA Forward Voltage: RGB: 1.8, 3.0, 3.2 V Packages:LED-TRICOLOR-5050-IC SparkFun Products: LED-SMD RGB (WS2812) <https://www.sparkfun.com/products/11821>; PROD_ID: DIO-11598
U$1 U$3 = KevinKuwata1:1N7002PW
U$2 U$4 = KevinKuwata1:WM6698TR-ND_MICROSD
Y1 Y2 = SparkFun-Clocks:RESONATOR: Resonators (Generic) Ceramic resonators are clock-generating components, often used to control timing in microcontrollers. They usually have 3 pins: two pins for oscillation, and one pin for ground. Compared to crystals, resonators have worse tolerance, but are usually much cheaper. Plus, they have built-in load capacitors! These devices are used on boards like the Arduino Pro 8MHz <https://www.sparkfun.com/products/11114> and Arduino Pro 16MHz <https://www.sparkfun.com/products/11113>.